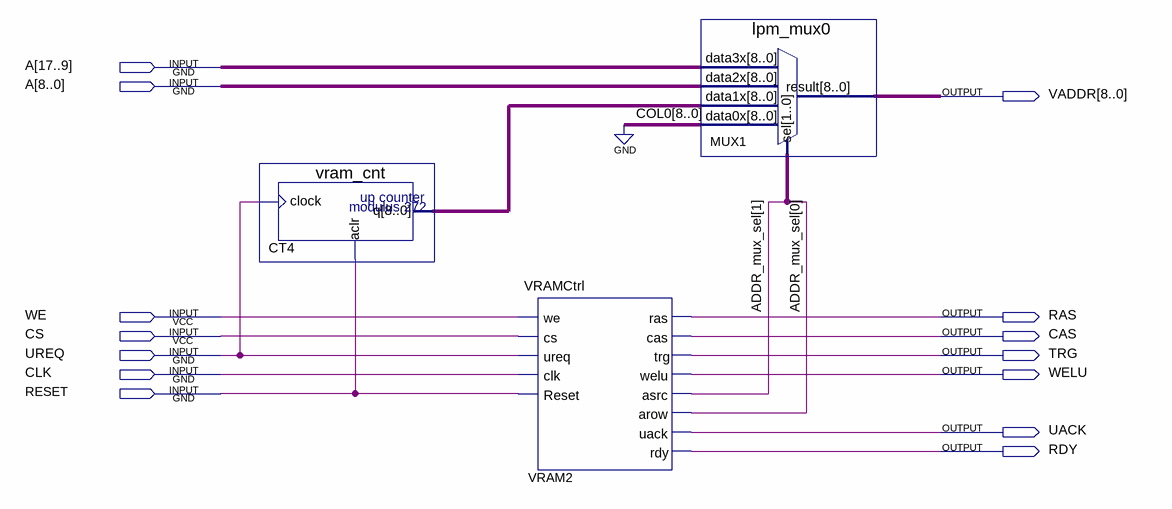
[diagram p0: schematic sheet]
// Quartus schematic vram_ctrl.bdf as structural Verilog: 3 symbols, 14 pins
module vram_ctrl (
  input  [17:0] A,
  input  WE,
  input  CS,
  input  UREQ,
  input  CLK,
  input  RESET,
  output [8:0] VADDR,
  output RAS,
  output CAS,
  output TRG,
  output WELU,
  output UACK,
  output RDY
);

  wire [1:0] ADDR_mux_sel;
  wire [8:0] CT4_q;

  vram_cnt CT4 (.clock(UREQ), .aclr(RESET), .q(CT4_q));
  VRAMCtrl VRAM2 (
    .we(WE), .cs(CS), .ureq(UREQ), .clk(CLK), .Reset(RESET), .ras(RAS), .cas(CAS), .trg(TRG), .welu(WELU),
    .asrc(ADDR_mux_sel[1]), .arow(ADDR_mux_sel[0]), .uack(UACK), .rdy(RDY));
  lpm_mux0 MUX1 (
    .data3x(A[17:9]), .data2x(A[8:0]), .data1x(CT4_q), .data0x({9{1'b0}}), .sel(ADDR_mux_sel), .result(VADDR));
endmodule
